# Altium schematic sheet Sheet2.SchDoc
size 420 x 297 mm; Scale: 1:1; Номер листа: 1; Общее количество листов: 3; Перв. применение: АБВГ.123456.000; Наименование изделия 1: ИВН; Наименование изделия 2: Схема электрическая; Наименование изделия 3: принципиальная
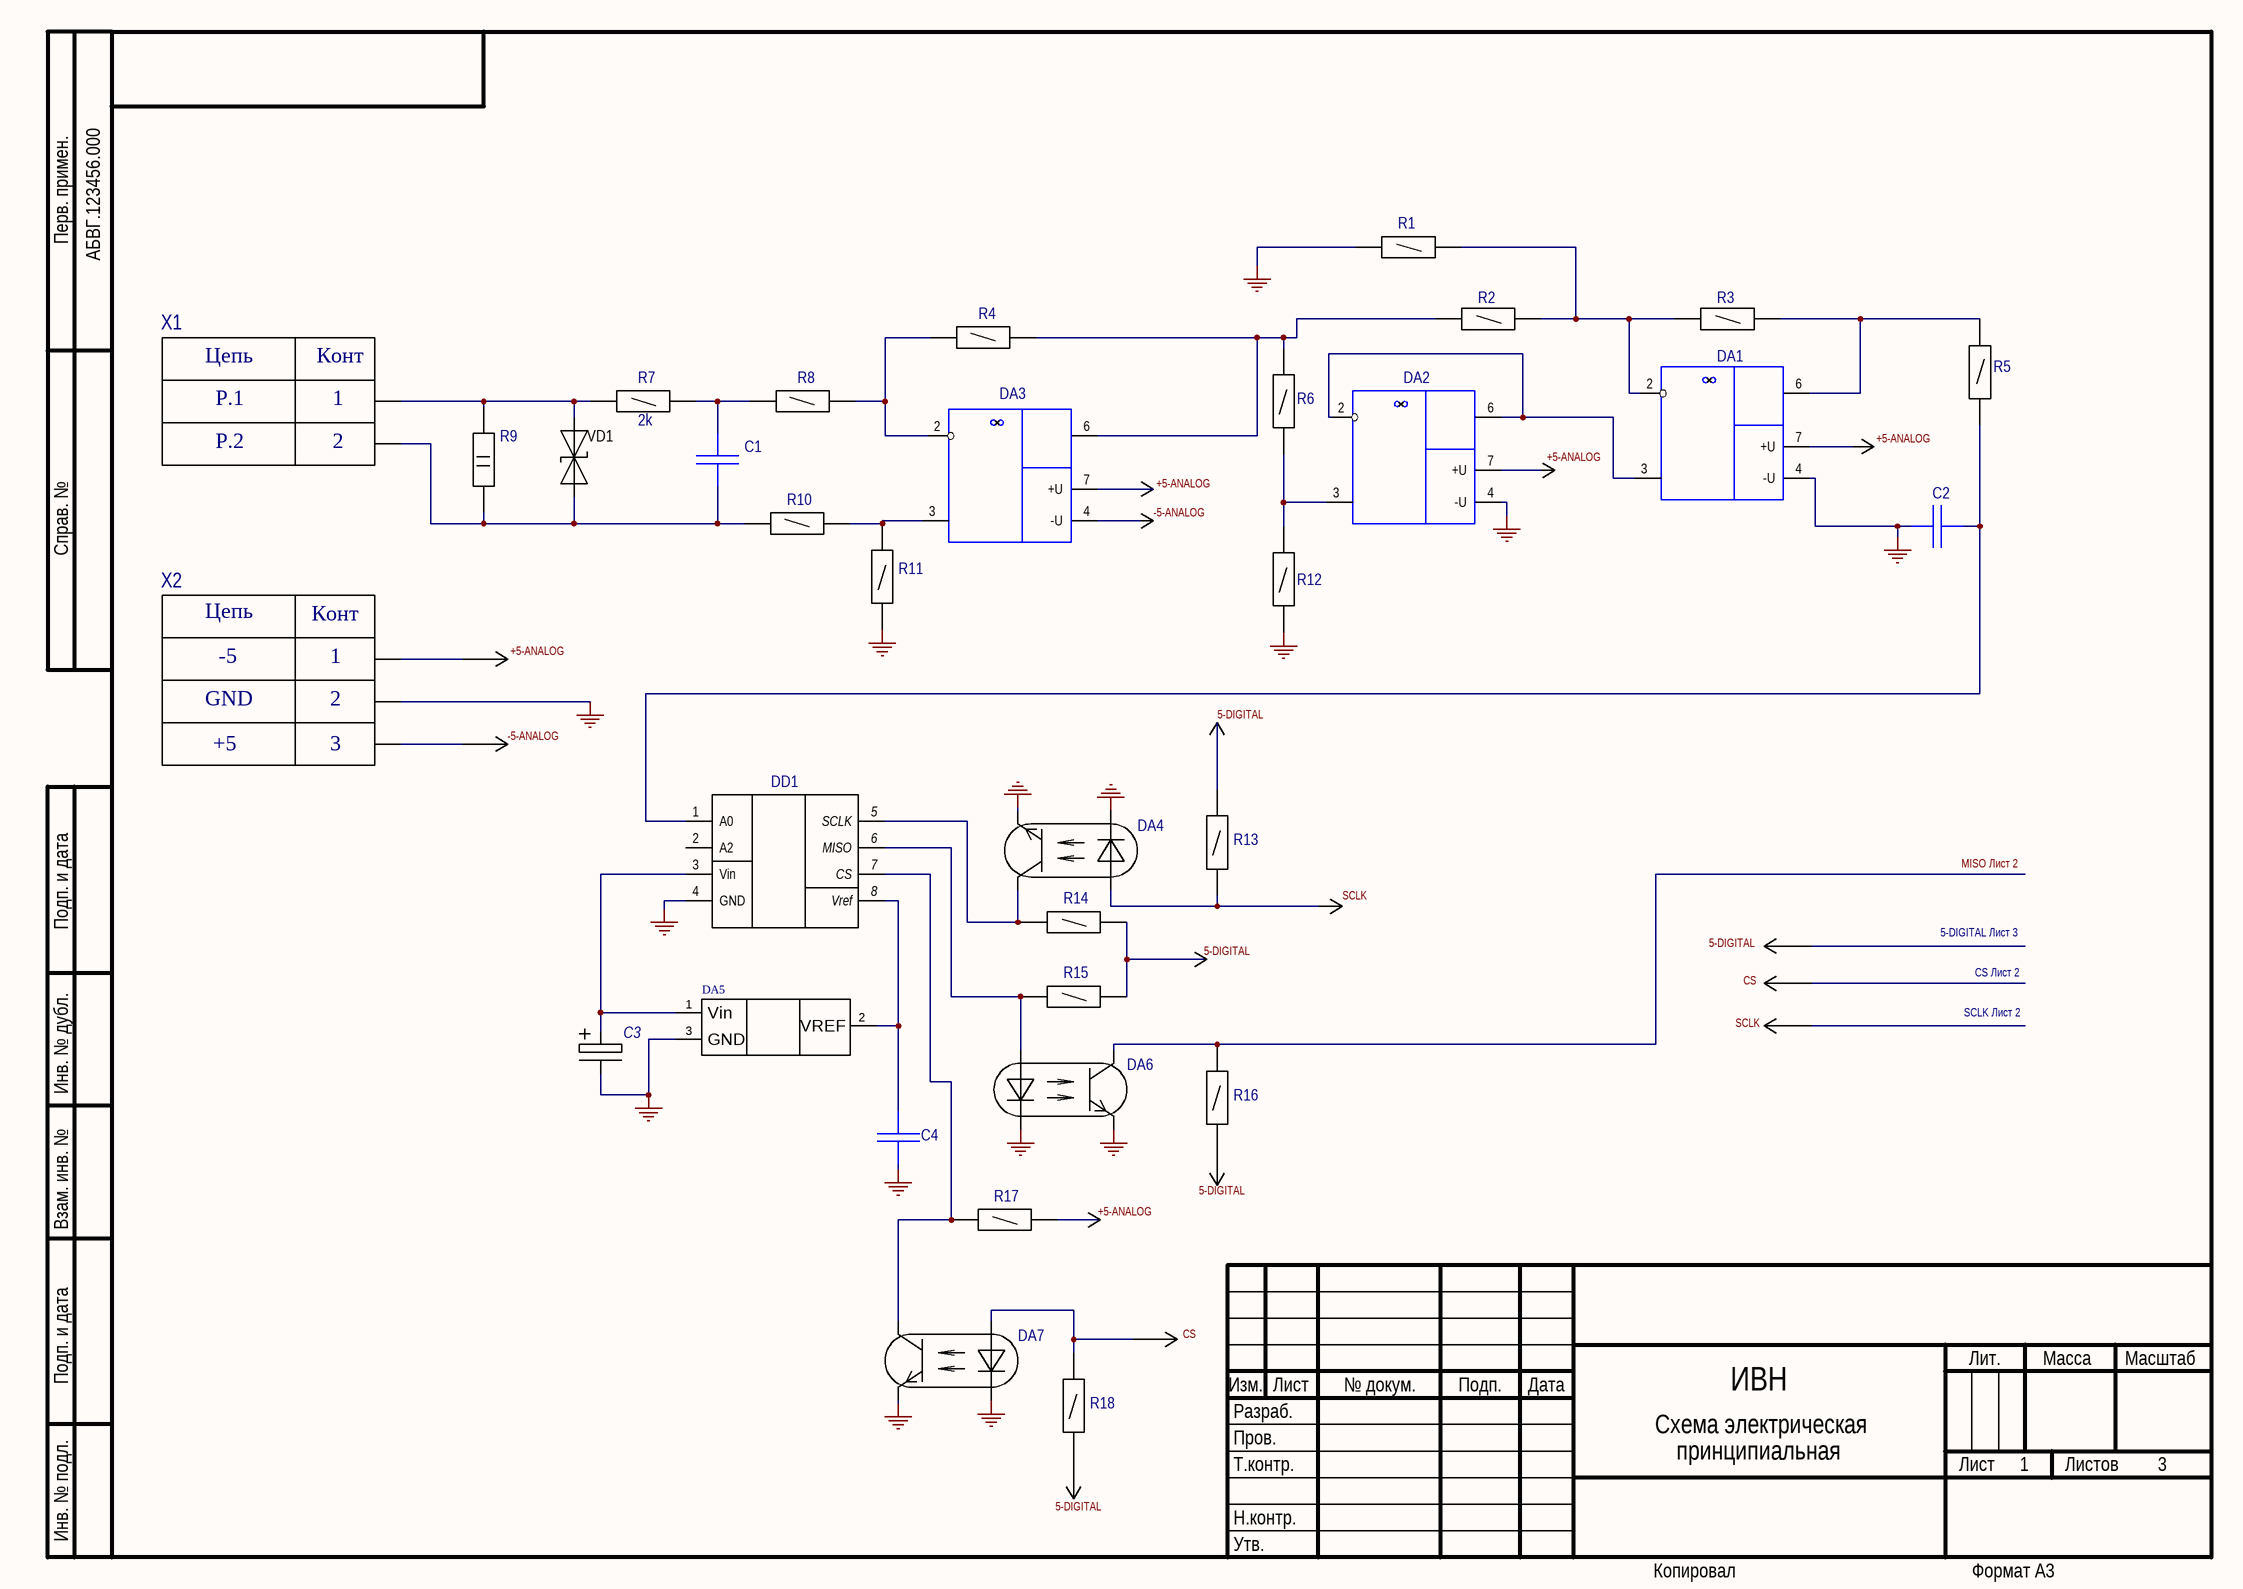
[diagram p0: Sheet2.SchDoc]

## Parts
C1  470n  [CAP SMD 1206]  (value not drawn)
C2  CAP  [CAP SMD 1812]  (value not drawn)
C3  (no value)  [Radial 5x11mm]
C4  CAP  [CAP SMD 1812]  (value not drawn)
DA1  MCP601-I/SN  [MCP601-I/SN]  (value not drawn)
DA2  MCP601-I/SN  [MCP601-I/SN]  (value not drawn)
DA3  LT1816CS  [MCP601-I/SN]  (value not drawn)
DA4  PC817  [DIP4]  (value not drawn)
DA5  MCP1541  [TO-92]  (value not drawn)
DA6  PC817  [DIP4]  (value not drawn)
DA7  PC817  [DIP4]  (value not drawn)
DD1  MCP3201  [MCP3201]  (value not drawn)
R1  resistor  [Resistor SMD 1206]  (value not drawn)
R2  resistor  [Resistor SMD 1206]  (value not drawn)
R3  resistor  [Resistor SMD 1206]  (value not drawn)
R4  21k  [Resistor SMD 1206]  (value not drawn)
R5  resistor  [Resistor SMD 1206]  (value not drawn)
R6  resistor  [Resistor SMD 1206]  (value not drawn)
R7  2k  [RESISTOR SMD 0805]
R8  10k  [Resistor SMD 1206]  (value not drawn)
R9  230  [RESISTOR SMD 2512]  (value not drawn)
R10  10k  [Resistor SMD 1206]  (value not drawn)
R11  resistor  [Resistor SMD 1206]  (value not drawn)
R12  resistor  [Resistor SMD 1206]  (value not drawn)
R13  resistor  [Resistor SMD 1206]  (value not drawn)
R14  resistor  [Resistor SMD 1206]  (value not drawn)
R15  resistor  [Resistor SMD 1206]  (value not drawn)
R16  resistor  [Resistor SMD 1206]  (value not drawn)
R17  resistor  [Resistor SMD 1206]  (value not drawn)
R18  resistor  [Resistor SMD 1206]  (value not drawn)
VD1  PESD5V0L1BA  [DIOM5226X230N]  (value not drawn)
X1  connector_shunt  [PLS-02]  (value not drawn)
X2  PLS3  [PLS-3]  (value not drawn)

## Nets
GND: C2.1 C3.1 C4.1 DA1.4(-U) DA2.4(-U) DA4.2 DA4.3 DA5.3(GND) DA6.2 DA6.3 DA7.2 DA7.3 DD1.4(GND) R1.2 R11.1 R12.1 X2.2
5-DIGITAL: R13.2 R14.1 R15.1
+5-ANALOG: R17.1
NetC1_1: C1.1 R7.1 R8.1
NetC1_2: C1.2 R9.1 R10.1 VD1.1 X1.1
NetC2_2: C2.2 DD1.1(A0) R5.2
NetC3_2: C3.2 DA5.1(Vin) DD1.3(Vin)
NetC4_2: C4.2 DA5.2(VREF) DD1.8(Vref)
NetDA1_2: DA1.2(-(инвентирующий)) R1.1 R2.1 R3.2
NetDA1_3: DA1.3(+(неинвентирующий)) DA2.2(-(инвентирующий)) DA2.6(X)
NetDA1_6: DA1.6(X) R3.1 R5.1
NetDA2_3: DA2.3(+(неинвентирующий)) R6.1 R12.2
NetDA3_2: DA3.2(-(инвентирующий)) R4.1 R8.2
NetDA3_3: DA3.3(+(неинвентирующий)) R10.2 R11.2
NetDA3_6: DA3.6(X) R2.2 R4.2 R6.2
NetDA4_1: DA4.1 R13.1
NetDA4_4: DA4.4 DD1.5(SCLK) R14.2
NetDA6_1: DA6.1 DD1.6(MISO) R15.2
NetDA6_4: DA6.4 R16.2
NetDA7_1: DA7.1 R18.2
NetDA7_4: DA7.4 DD1.7(CS) R17.2
NetR7_2: R7.2 R9.2 VD1.2 X1.2

Not connected (* = marked no-connect by the designer): DA1 7(+U); DA2 7(+U); DA3 4(-U) 7(+U); DD1 2(A2); R16 1; R18 1; X2 1 3

## Notes on the sheet
- 5-DIGITAL Лист 3
- CS Лист 2
- SCLK Лист 2
- Labels drawn without touching a wire or pin: 5-DIGITAL, +5-ANALOG, -5-ANALOG, CS, MISO Лист 2, SCLK
- Перв. примен.
- Справ. №
- Подп. и дата
- Инв. № дубл.
- Взам. инв. №
- Разраб.
- Изм.
- Лист
- № докум.
- Подп.
- Дата
- Лит.
- Масса
- Масштаб
- Пров.
- Т.контр.
- Листов
- Инв. № подл.
- Утв.
- Н.контр.
- Копировал
- Формат А3
- (in symbol connector_shunt) Цепь; Конт; P.1; P.2
- (in symbol PLS3) Цепь; Конт; -5; GND; +5

## Library data of the parts
C1 = CAP
C3 = CapPol_1
R4 R7 R8 R10 = resistor
R9 = 2W RES
VD1 = VD_TVS